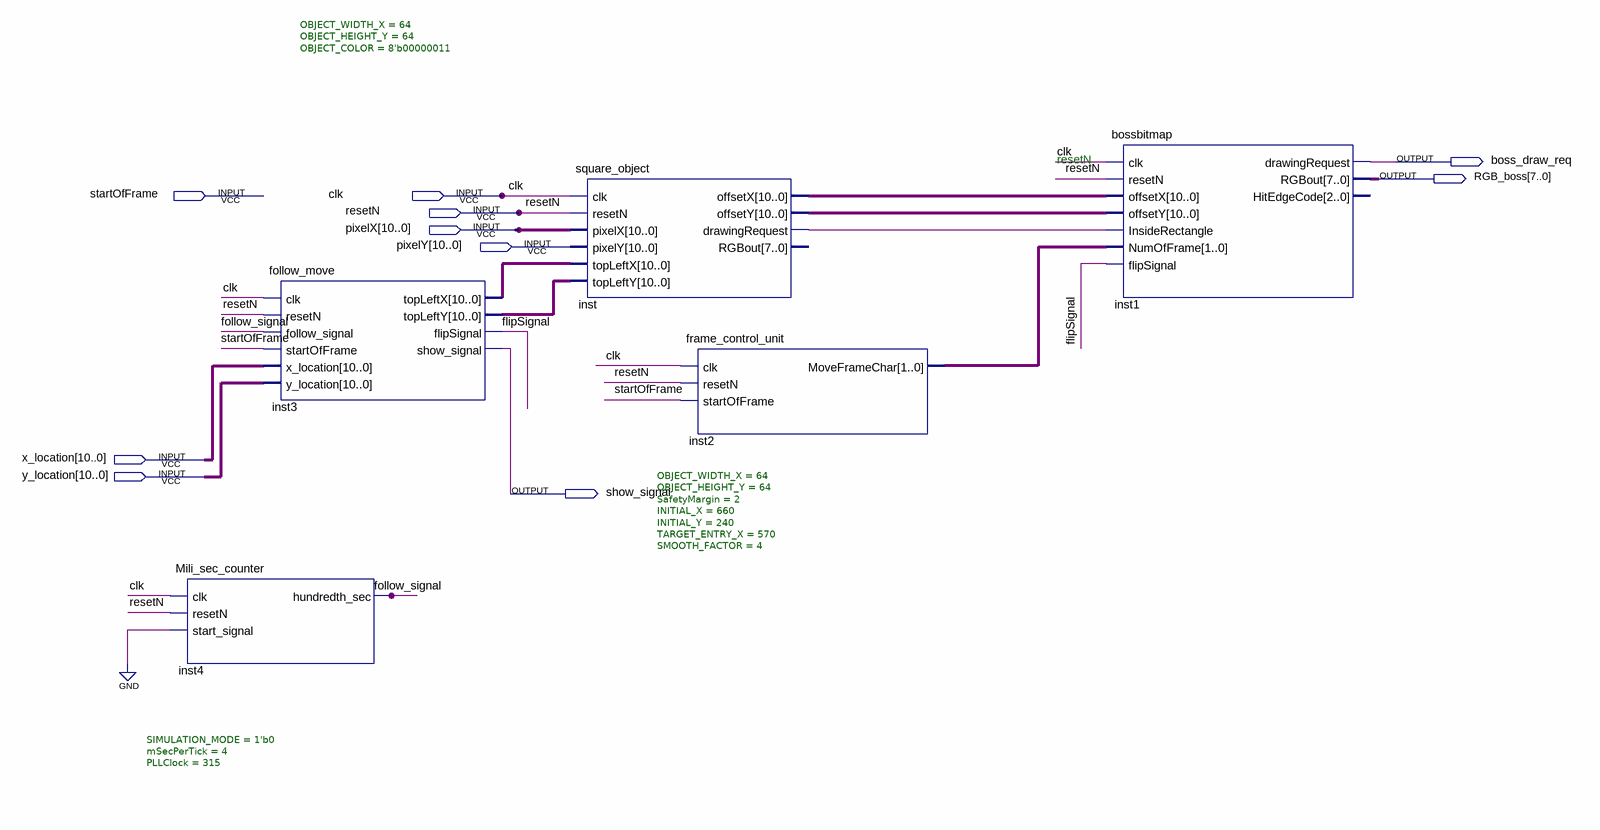
[diagram p0: schematic sheet]
// Quartus schematic big_boss_top.bdf as structural Verilog: 5 symbols, 10 pins
module big_boss_top (
  input  startOfFrame,
  input  clk,
  input  resetN,
  input  [10:0] pixelX,
  input  [10:0] pixelY,
  input  [10:0] x_location,
  input  [10:0] y_location,
  output boss_draw_req,
  output [7:0] RGB_boss,
  output show_signal
);

  wire flipSignal, follow_signal, inst_drawingrequest;
  wire [1:0] inst2_moveframechar;
  wire [10:0] inst3_topleftx, inst3_toplefty, inst_offsetx, inst_offsety;

  Mili_sec_counter #(.SIMULATION_MODE(1'b0), .mSecPerTick(4), .PLLClock(315)) inst4 (
    .clk(clk), .resetN(resetN), .start_signal(1'b0), .hundredth_sec(follow_signal));
  follow_move #(.OBJECT_WIDTH_X(64), .OBJECT_HEIGHT_Y(64), .SafetyMargin(2), .INITIAL_X(660), .INITIAL_Y(240), .TARGET_ENTRY_X(570), .SMOOTH_FACTOR(4)) inst3 (
    .clk(clk), .resetN(resetN), .follow_signal(follow_signal), .startOfFrame(startOfFrame),
    .x_location(x_location), .y_location(y_location), .topLeftX(inst3_topleftx), .topLeftY(inst3_toplefty),
    .flipSignal(flipSignal), .show_signal(show_signal));
  square_object #(.OBJECT_WIDTH_X(64), .OBJECT_HEIGHT_Y(64), .OBJECT_COLOR(8'b00000011)) inst (
    .clk(clk), .resetN(resetN), .pixelX(pixelX), .pixelY(pixelY), .topLeftX(inst3_topleftx),
    .topLeftY(inst3_toplefty), .offsetX(inst_offsetx), .offsetY(inst_offsety),
    .drawingRequest(inst_drawingrequest));  // open: RGBout
  frame_control_unit inst2 (
    .clk(clk), .resetN(resetN), .startOfFrame(startOfFrame), .MoveFrameChar(inst2_moveframechar));
  bossbitmap inst1 (
    .clk(clk), .resetN(resetN), .offsetX(inst_offsetx), .offsetY(inst_offsety),
    .InsideRectangle(inst_drawingrequest), .NumOfFrame(inst2_moveframechar), .flipSignal(flipSignal),
    .drawingRequest(boss_draw_req), .RGBout(RGB_boss));  // open: HitEdgeCode

  // Notes on the sheet:
  //   resetN
endmodule
